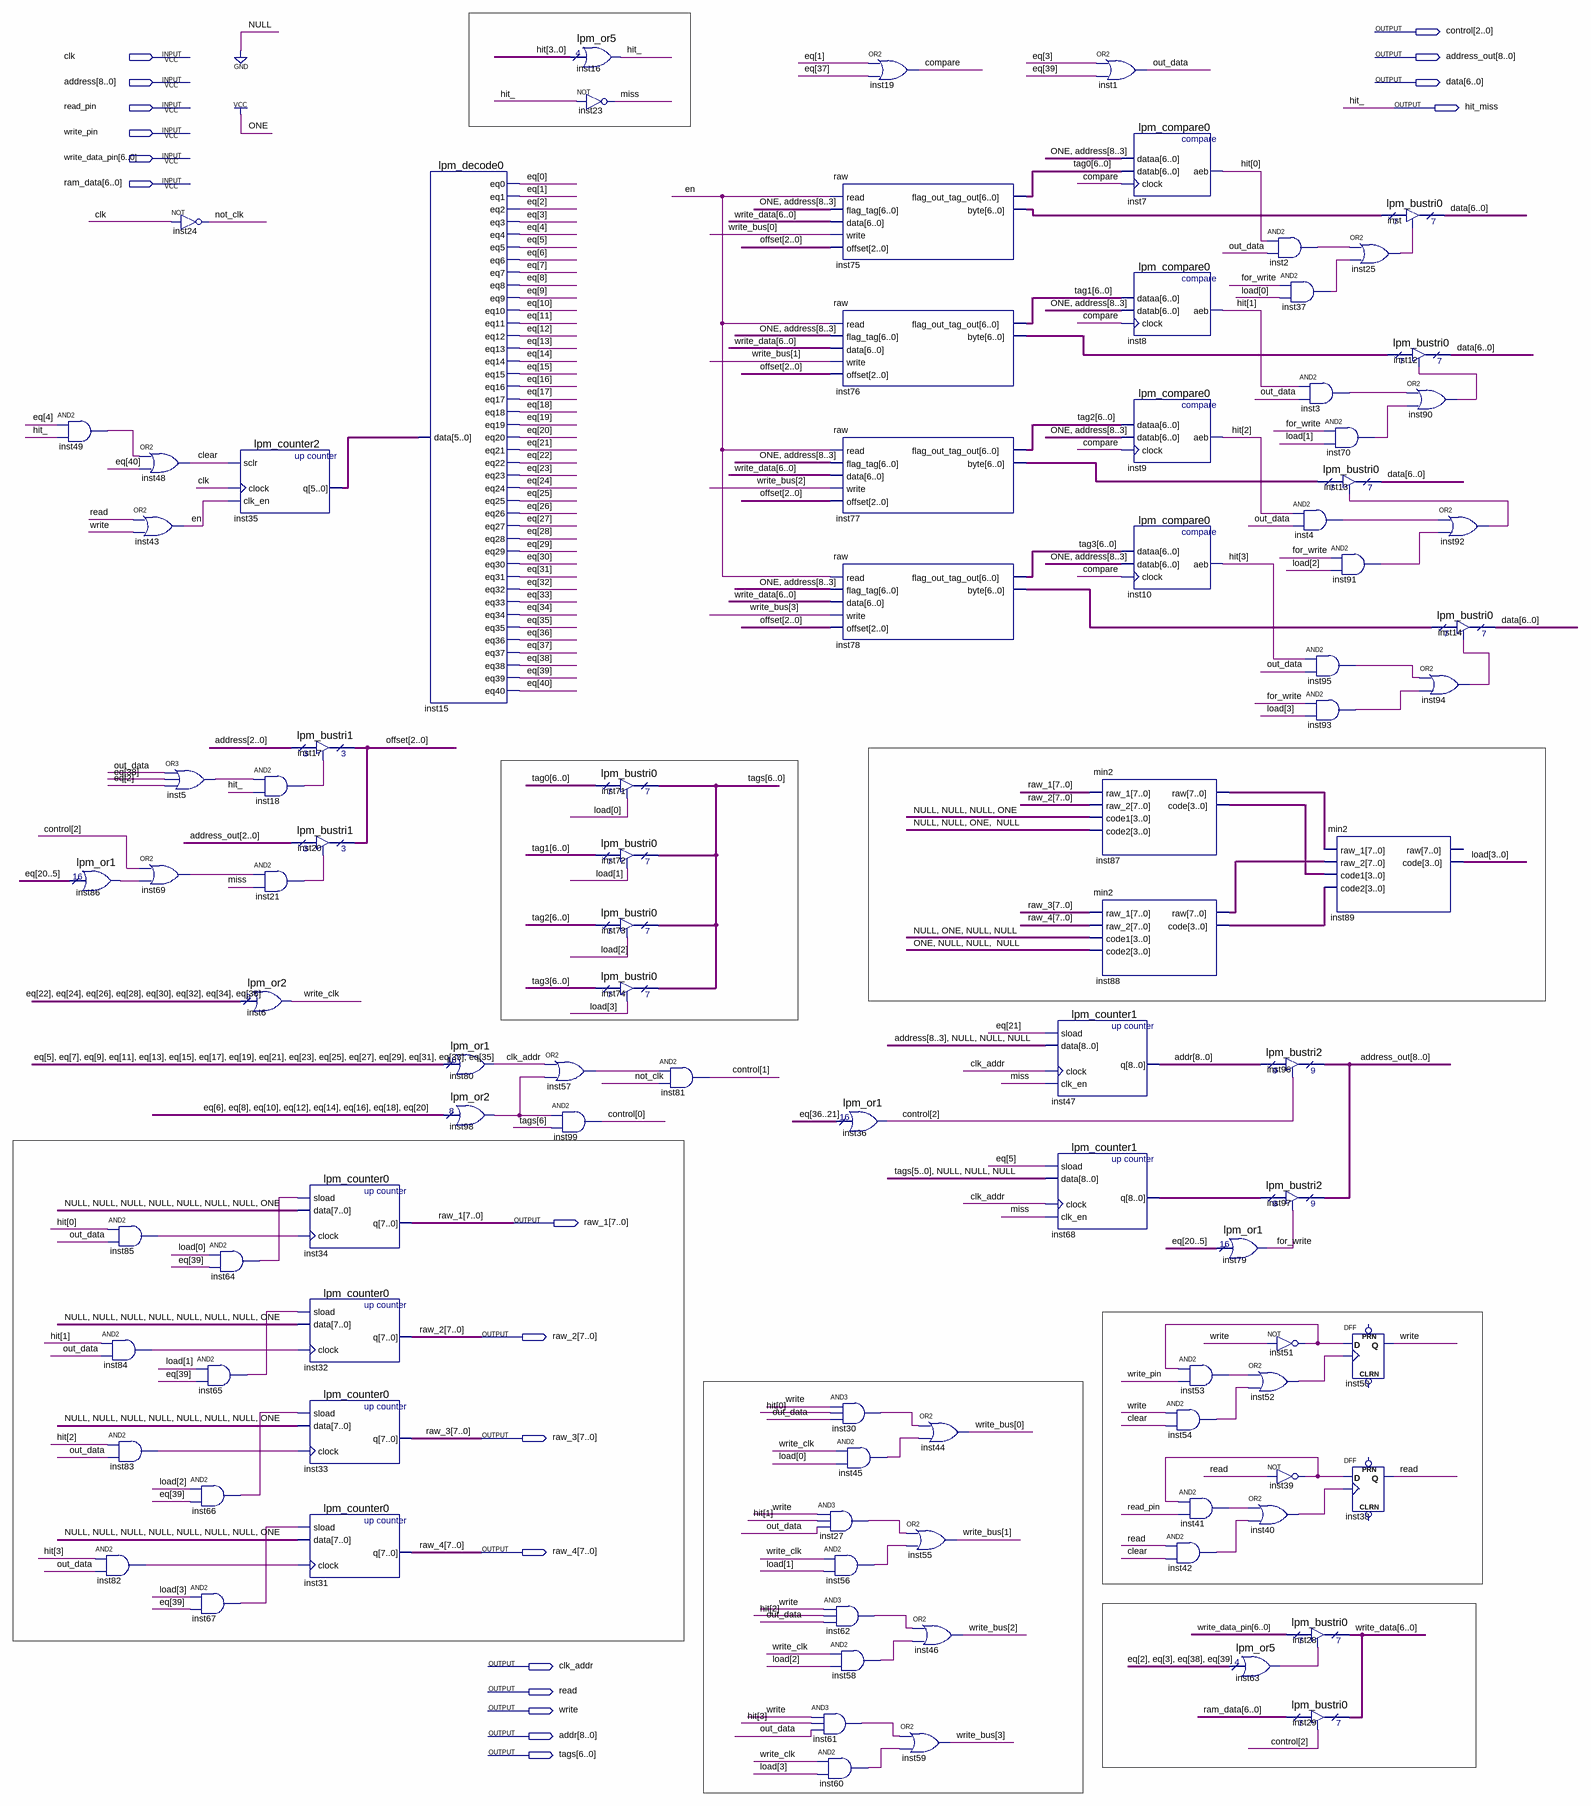
[diagram p0: schematic sheet]
// Quartus schematic cashe_temp.bdf as structural Verilog: 97 symbols, 19 pins
module cashe_temp (
  input  clk,
  input  [8:0] address,
  input  read_pin,
  input  write_pin,
  input  [6:0] write_data_pin,
  input  [6:0] ram_data,
  output [2:0] control,
  output [8:0] address_out,
  output [6:0] data,
  output hit_miss,
  output [7:0] raw_1,
  output [7:0] raw_2,
  output [7:0] raw_3,
  output [7:0] raw_4,
  output clk_addr,
  output read,
  output write,
  output [8:0] addr,
  output [6:0] tags
);

  wire clear, compare, en, for_write, inst2_out, inst3_out, inst4_out, inst5_out, inst18_out, inst21_out,
       inst25_out, inst27_out, inst30_out, inst37_out, inst39_out, inst40_out, inst41_out, inst42_out,
       inst45_out, inst49_out, inst51_out, inst52_out, inst53_out, inst54_out, inst56_out, inst57_out,
       inst58_out, inst60_out, inst61_out, inst62_out, inst63_result, inst64_out, inst65_out, inst66_out,
       inst67_out, inst69_out, inst70_out, inst82_out, inst83_out, inst84_out, inst85_out, inst86_result,
       inst90_out, inst91_out, inst92_out, inst93_out, inst94_out, inst95_out, inst98_result, miss, not_clk,
       out_data, write_clk;
  wire [2:0] offset;
  wire [3:0] hit, inst87_code, inst88_code, load, write_bus;
  wire [5:0] inst35_q;
  wire [6:0] inst75_byte, inst76_byte, inst77_byte, inst78_byte, tag0, tag1, tag2, tag3, write_data;
  wire [7:0] inst87_raw, inst88_raw;
  wire [8:0] inst68_q;
  wire [40:0] eq;

  and inst49 (inst49_out, eq[4], hit_miss);
  lpm_or1 inst86 (.data(eq[20:5]), .result(inst86_result));
  and inst85 (inst85_out, hit[0], out_data);
  and inst84 (inst84_out, hit[1], out_data);
  and inst83 (inst83_out, hit[2], out_data);
  and inst82 (inst82_out, hit[3], out_data);
  or inst48 (clear, inst49_out, eq[40]);
  or inst43 (en, read, write);
  or inst69 (inst69_out, control[2], inst86_result);
  not inst24 (not_clk, clk);
  or inst5 (inst5_out, out_data, eq[38], eq[2]);
  and inst64 (inst64_out, load[0], eq[39]);
  and inst65 (inst65_out, load[1], eq[39]);
  and inst66 (inst66_out, load[2], eq[39]);
  and inst67 (inst67_out, load[3], eq[39]);
  lpm_counter2 inst35 (.sclr(clear), .clock(clk), .clk_en(en), .q(inst35_q));
  and inst18 (inst18_out, inst5_out, hit_miss);
  and inst21 (inst21_out, inst69_out, miss);
  lpm_or2 inst6 (.data({eq[22], eq[24], eq[26], eq[28], eq[30], eq[32], eq[34], eq[36]}), .result(write_clk));
  lpm_bustri1 inst17 (.enabledt(inst18_out), .data(address[2:0]), .tridata(offset));
  lpm_bustri1 inst20 (.enabledt(inst21_out), .data(address_out[2:0]), .tridata(offset));
  lpm_counter0 inst34 (.sload(inst64_out), .data(8'b00000001), .clock(inst85_out), .q(raw_1));
  lpm_counter0 inst32 (.sload(inst65_out), .data(8'b00000001), .clock(inst84_out), .q(raw_2));
  lpm_counter0 inst33 (.sload(inst66_out), .data(8'b00000001), .clock(inst83_out), .q(raw_3));
  lpm_counter0 inst31 (.sload(inst67_out), .data(8'b00000001), .clock(inst82_out), .q(raw_4));
  lpm_decode0 inst15 (
    .data(inst35_q), .eq0(eq[0]), .eq1(eq[1]), .eq2(eq[2]), .eq3(eq[3]), .eq4(eq[4]), .eq5(eq[5]),
    .eq6(eq[6]), .eq7(eq[7]), .eq8(eq[8]), .eq9(eq[9]), .eq10(eq[10]), .eq11(eq[11]), .eq12(eq[12]),
    .eq13(eq[13]), .eq14(eq[14]), .eq15(eq[15]), .eq16(eq[16]), .eq17(eq[17]), .eq18(eq[18]), .eq19(eq[19]),
    .eq20(eq[20]), .eq21(eq[21]), .eq22(eq[22]), .eq23(eq[23]), .eq24(eq[24]), .eq25(eq[25]), .eq26(eq[26]),
    .eq27(eq[27]), .eq28(eq[28]), .eq29(eq[29]), .eq30(eq[30]), .eq31(eq[31]), .eq32(eq[32]), .eq33(eq[33]),
    .eq34(eq[34]), .eq35(eq[35]), .eq36(eq[36]), .eq37(eq[37]), .eq38(eq[38]), .eq39(eq[39]), .eq40(eq[40]));
  lpm_or1 inst80 (
    .data({eq[5], eq[7], eq[9], eq[11], eq[13], eq[15], eq[17], eq[19], eq[21], eq[23], eq[25], eq[27], eq[29], eq[31], eq[33], eq[35]}),
    .result(clk_addr));
  lpm_or2 inst98 (.data({eq[6], eq[8], eq[10], eq[12], eq[14], eq[16], eq[18], eq[20]}), .result(inst98_result));
  or inst57 (inst57_out, clk_addr, inst98_result);
  and inst99 (control[0], inst98_result, tags[6]);
  lpm_or5 inst16 (.data(hit), .result(hit_miss));
  not inst23 (miss, hit_miss);
  lpm_bustri0 inst71 (.enabledt(load[0]), .data(tag0), .tridata(tags));
  lpm_bustri0 inst72 (.enabledt(load[1]), .data(tag1), .tridata(tags));
  lpm_bustri0 inst73 (.enabledt(load[2]), .data(tag2), .tridata(tags));
  lpm_bustri0 inst74 (.enabledt(load[3]), .data(tag3), .tridata(tags));
  and inst81 (control[1], inst57_out, not_clk);
  and inst27 (inst27_out, write, hit[1], out_data);
  and inst61 (inst61_out, write, hit[3], out_data);
  and inst60 (inst60_out, write_clk, load[3]);
  or inst19 (compare, eq[1], eq[37]);
  raw inst75 (
    .read(en), .flag_tag({1'b1, address[8:3]}), .data(write_data), .write(write_bus[0]), .offset(offset),
    .flag_out_tag_out(tag0), .\byte (inst75_byte));
  raw inst76 (
    .read(en), .flag_tag({1'b1, address[8:3]}), .data(write_data), .write(write_bus[1]), .offset(offset),
    .flag_out_tag_out(tag1), .\byte (inst76_byte));
  raw inst77 (
    .read(en), .flag_tag({1'b1, address[8:3]}), .data(write_data), .write(write_bus[2]), .offset(offset),
    .flag_out_tag_out(tag2), .\byte (inst77_byte));
  raw inst78 (
    .read(en), .flag_tag({1'b1, address[8:3]}), .data(write_data), .write(write_bus[3]), .offset(offset),
    .flag_out_tag_out(tag3), .\byte (inst78_byte));
  lpm_or1 inst36 (.data(eq[36:21]), .result(control[2]));
  and inst30 (inst30_out, write, hit[0], out_data);
  and inst45 (inst45_out, write_clk, load[0]);
  and inst56 (inst56_out, write_clk, load[1]);
  and inst62 (inst62_out, write, hit[2], out_data);
  and inst58 (inst58_out, write_clk, load[2]);
  or inst44 (write_bus[0], inst30_out, inst45_out);
  or inst55 (write_bus[1], inst27_out, inst56_out);
  or inst46 (write_bus[2], inst62_out, inst58_out);
  or inst59 (write_bus[3], inst61_out, inst60_out);
  lpm_counter1 inst47 (.sload(eq[21]), .data({address[8:3], 3'b000}), .clock(clk_addr), .clk_en(miss), .q(addr));
  lpm_counter1 inst68 (.sload(eq[5]), .data({tags[5:0], 3'b000}), .clock(clk_addr), .clk_en(miss), .q(inst68_q));
  or inst1 (out_data, eq[3], eq[39]);
  lpm_compare0 inst7 (.dataa({1'b1, address[8:3]}), .datab(tag0), .clock(compare), .aeb(hit[0]));
  lpm_compare0 inst8 (.dataa(tag1), .datab({1'b1, address[8:3]}), .clock(compare), .aeb(hit[1]));
  lpm_compare0 inst9 (.dataa(tag2), .datab({1'b1, address[8:3]}), .clock(compare), .aeb(hit[2]));
  lpm_compare0 inst10 (.dataa(tag3), .datab({1'b1, address[8:3]}), .clock(compare), .aeb(hit[3]));
  min2 inst87 (.raw_1(raw_1), .raw_2(raw_2), .code1(4'b0001), .code2(4'b0010), .raw(inst87_raw), .code(inst87_code));
  min2 inst88 (.raw_1(raw_3), .raw_2(raw_4), .code1(4'b0100), .code2(4'b1000), .raw(inst88_raw), .code(inst88_code));
  and inst54 (inst54_out, write, clear);
  and inst42 (inst42_out, read, clear);
  lpm_or1 inst79 (.data(eq[20:5]), .result(for_write));
  and inst53 (inst53_out, inst51_out, write_pin);
  and inst41 (inst41_out, inst39_out, read_pin);
  and inst2 (inst2_out, hit[0], out_data);
  lpm_bustri2 inst96 (.enabledt(control[2]), .data(addr), .tridata(address_out));
  lpm_bustri2 inst97 (.enabledt(for_write), .data(inst68_q), .tridata(address_out));
  not inst51 (inst51_out, write);
  or inst52 (inst52_out, inst53_out, inst54_out);
  not inst39 (inst39_out, read);
  or inst40 (inst40_out, inst41_out, inst42_out);
  lpm_or5 inst63 (.data({eq[2], eq[3], eq[38], eq[39]}), .result(inst63_result));
  and inst37 (inst37_out, for_write, load[0]);
  and inst3 (inst3_out, hit[1], out_data);
  and inst70 (inst70_out, for_write, load[1]);
  lpm_bustri0 inst13 (.enabledt(inst92_out), .data(inst77_byte), .tridata(data));
  and inst4 (inst4_out, hit[2], out_data);
  and inst95 (inst95_out, hit[3], out_data);
  and inst93 (inst93_out, for_write, load[3]);
  min2 inst89 (
    .raw_1(inst87_raw), .raw_2(inst88_raw), .code1(inst87_code), .code2(inst88_code), .code(load));  // open: raw
  lpm_bustri0 inst28 (.enabledt(inst63_result), .data(write_data_pin), .tridata(write_data));
  lpm_bustri0 inst29 (.enabledt(control[2]), .data(ram_data), .tridata(write_data));
  or inst25 (inst25_out, inst2_out, inst37_out);
  and inst91 (inst91_out, for_write, load[2]);
  DFF inst50 (.CLK(inst52_out), .D(inst51_out), .Q(write));  // open: CLRN, PRN
  DFF inst38 (.CLK(inst40_out), .D(inst39_out), .Q(read));  // open: CLRN, PRN
  lpm_bustri0 inst (.enabledt(inst25_out), .data(inst75_byte), .tridata(data));
  lpm_bustri0 inst12 (.enabledt(inst90_out), .data(inst76_byte), .tridata(data));
  or inst90 (inst90_out, inst3_out, inst70_out);
  or inst94 (inst94_out, inst95_out, inst93_out);
  or inst92 (inst92_out, inst4_out, inst91_out);
  lpm_bustri0 inst14 (.enabledt(inst94_out), .data(inst78_byte), .tridata(data));

  // Other names for the same wires on the sheet: hit_ = hit_miss
endmodule
